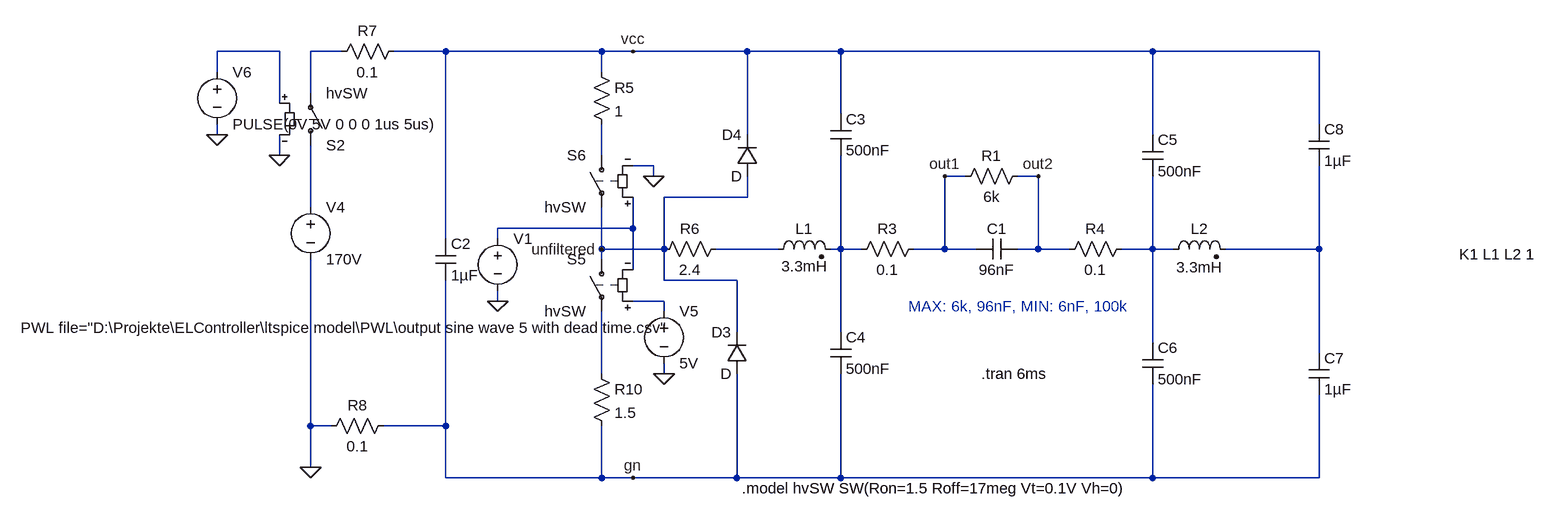
[diagram p0: schematic Filter Test R4d.asc]
Filter Test R4d.asc, the LTspice schematic file:
Version 4
SHEET 1 2672 680
WIRE -848 -224 -944 -224
WIRE -752 -224 -800 -224
WIRE -592 -224 -672 -224
WIRE -352 -224 -592 -224
WIRE -304 -224 -352 -224
WIRE -128 -224 -304 -224
WIRE 16 -224 -128 -224
WIRE 496 -224 16 -224
WIRE 752 -224 496 -224
WIRE -944 -192 -944 -224
WIRE -352 -192 -352 -224
WIRE -800 -160 -800 -224
WIRE -848 -144 -848 -224
WIRE 16 -128 16 -224
WIRE 752 -112 752 -224
WIRE -944 -96 -944 -112
WIRE -128 -96 -128 -224
WIRE 496 -96 496 -224
WIRE -848 -64 -848 -96
WIRE -352 -64 -352 -112
WIRE -272 -48 -304 -48
WIRE -272 -32 -272 -48
WIRE 208 -32 176 -32
WIRE 320 -32 288 -32
WIRE -128 0 -128 -32
WIRE -128 0 -256 0
WIRE -800 16 -800 -80
WIRE -304 48 -304 0
WIRE -304 48 -512 48
WIRE -592 64 -592 -224
WIRE -512 64 -512 48
WIRE -352 80 -352 16
WIRE -256 80 -256 0
WIRE -256 80 -352 80
WIRE -80 80 -176 80
WIRE 16 80 16 -64
WIRE 16 80 0 80
WIRE 48 80 16 80
WIRE 176 80 176 -32
WIRE 176 80 128 80
WIRE 224 80 176 80
WIRE 320 80 320 -32
WIRE 320 80 288 80
WIRE 368 80 320 80
WIRE 496 80 496 -32
WIRE 496 80 448 80
WIRE 528 80 496 80
WIRE 752 80 752 -48
WIRE 752 80 608 80
WIRE -352 96 -352 80
WIRE -304 112 -304 48
WIRE -256 128 -256 80
WIRE -144 128 -256 128
WIRE -512 160 -512 144
WIRE -256 160 -304 160
WIRE -256 176 -256 160
WIRE -144 208 -144 128
WIRE 16 208 16 80
WIRE 496 224 496 80
WIRE 752 240 752 80
WIRE -352 272 -352 176
WIRE -256 272 -256 256
WIRE -800 352 -800 96
WIRE -768 352 -800 352
WIRE -592 352 -592 128
WIRE -592 352 -688 352
WIRE -800 416 -800 352
WIRE -592 432 -592 352
WIRE -352 432 -352 352
WIRE -352 432 -592 432
WIRE -304 432 -352 432
WIRE -144 432 -144 272
WIRE -144 432 -304 432
WIRE 16 432 16 272
WIRE 16 432 -144 432
WIRE 496 432 496 288
WIRE 496 432 16 432
WIRE 752 432 752 304
WIRE 752 432 496 432
FLAG 176 -32 out1
FLAG 320 -32 out2
FLAG -800 416 0
FLAG -256 272 0
FLAG -272 -32 0
FLAG -512 160 0
FLAG -304 -224 vcc
FLAG -304 432 gn
FLAG -352 80 unfiltered
FLAG -848 -64 0
FLAG -944 -96 0
SYMBOL voltage -512 48 R0
WINDOW 123 0 0 Left 0
WINDOW 39 0 0 Left 0
WINDOW 3 -734 153 Left 2
SYMATTR Value PWL file="D:\Projekte\ELController\ltspice model\PWL\output sine wave 5 with dead time.csv"
SYMATTR InstName V1
SYMBOL cap 288 64 R90
WINDOW 0 0 32 VBottom 2
WINDOW 3 32 32 VTop 2
SYMATTR InstName C1
SYMATTR Value 96nF
SYMBOL ind2 -96 96 R270
WINDOW 0 32 56 VTop 2
WINDOW 3 5 56 VBottom 2
SYMATTR InstName L1
SYMATTR Value 3.3mH
SYMATTR SpiceLine Ipk=1
SYMATTR Type ind
SYMBOL ind2 512 96 R270
WINDOW 0 32 56 VTop 2
WINDOW 3 4 56 VBottom 2
SYMATTR InstName L2
SYMATTR Value 3.3mH
SYMATTR SpiceLine Ipk=1
SYMATTR Type ind
SYMBOL res 304 -48 R90
WINDOW 0 0 56 VBottom 2
WINDOW 3 32 56 VTop 2
SYMATTR InstName R1
SYMATTR Value 6k
SYMBOL sw -352 80 M0
SYMATTR InstName S5
SYMATTR Value hvSW
SYMBOL sw -352 -80 M0
SYMATTR InstName S6
SYMATTR Value hvSW
SYMBOL voltage -256 160 R0
WINDOW 123 0 0 Left 0
WINDOW 39 0 0 Left 0
SYMATTR InstName V5
SYMATTR Value 5V
SYMBOL res -160 64 R90
WINDOW 0 0 56 VBottom 2
WINDOW 3 32 56 VTop 2
SYMATTR InstName R6
SYMATTR Value 2.4
SYMBOL cap -608 64 R0
SYMATTR InstName C2
SYMATTR Value 1µF
SYMBOL res -656 -240 R90
WINDOW 0 0 56 VBottom 2
WINDOW 3 32 56 VTop 2
SYMATTR InstName R7
SYMATTR Value 0.1
SYMBOL res -672 336 R90
WINDOW 0 0 56 VBottom 2
WINDOW 3 32 56 VTop 2
SYMATTR InstName R8
SYMATTR Value 0.1
SYMBOL voltage -800 0 R0
WINDOW 123 0 0 Left 0
WINDOW 39 0 0 Left 0
SYMATTR InstName V4
SYMATTR Value 170V
SYMBOL res 144 64 R90
WINDOW 0 0 56 VBottom 2
WINDOW 3 32 56 VTop 2
SYMATTR InstName R3
SYMATTR Value 0.1
SYMBOL res 464 64 R90
WINDOW 0 0 56 VBottom 2
WINDOW 3 32 56 VTop 2
SYMATTR InstName R4
SYMATTR Value 0.1
SYMBOL res -368 -208 R0
SYMATTR InstName R5
SYMATTR Value 1
SYMBOL res -368 256 R0
SYMATTR InstName R10
SYMATTR Value 1.5
SYMBOL diode -128 272 R180
WINDOW 0 24 64 Left 2
WINDOW 3 24 0 Left 2
SYMATTR InstName D3
SYMBOL diode -112 -32 R180
WINDOW 0 24 64 Left 2
WINDOW 3 24 0 Left 2
SYMATTR InstName D4
SYMBOL sw -800 -64 M180
SYMATTR InstName S2
SYMATTR Value hvSW
SYMBOL voltage -944 -208 R0
WINDOW 123 0 0 Left 0
WINDOW 39 0 0 Left 0
SYMATTR InstName V6
SYMATTR Value PULSE(0V 5V 0 0 0 1us 5us)
SYMBOL cap 0 -128 R0
SYMATTR InstName C3
SYMATTR Value 500nF
SYMBOL cap 0 208 R0
SYMATTR InstName C4
SYMATTR Value 500nF
SYMBOL cap 480 -96 R0
SYMATTR InstName C5
SYMATTR Value 500nF
SYMBOL cap 480 224 R0
SYMATTR InstName C6
SYMATTR Value 500nF
SYMBOL cap 736 240 R0
SYMATTR InstName C7
SYMATTR Value 1µF
SYMBOL cap 736 -112 R0
SYMATTR InstName C8
SYMATTR Value 1µF
TEXT 232 272 Left 2 !.tran 6ms
TEXT -136 448 Left 2 !.model hvSW SW(Ron=1.5 Roff=17meg Vt=0.1V Vh=0)
TEXT 120 168 Left 2 ;MAX: 6k, 96nF, MIN: 6nF, 100k
TEXT 968 88 Left 2 !K1 L1 L2 1

The netlist it stands for:
* Filter Test R4d.asc
V1 N005 0 PWL file="D:\Projekte\ELController\ltspice model\PWL\output sine wave 5 with dead time.csv"
C1 out2 out1 96nF
L1 N006 N007 3.3mH Ipk=1
L2 N008 N009 3.3mH Ipk=1
R1 out2 out1 6k
S5 unfiltered N011 N010 N005 hvSW
S6 N003 unfiltered N005 0 hvSW
V5 N010 0 5V
R6 N006 unfiltered 2.4
C2 vcc gn 1µF
R7 vcc N002 0.1
R8 gn 0 0.1
V4 N004 0 170V
R3 out1 N007 0.1
R4 N008 out2 0.1
R5 vcc N003 1
R10 N011 gn 1.5
D3 gn unfiltered D
D4 unfiltered vcc D
S2 N004 N002 N001 0 hvSW
V6 N001 0 PULSE(0V 5V 0 0 0 1us 5us)
C3 vcc N007 500nF
C4 N007 gn 500nF
C5 vcc N008 500nF
C6 N008 gn 500nF
C7 N009 gn 1µF
C8 vcc N009 1µF
.model D D
.lib standard.dio
.tran 6ms
.model hvSW SW(Ron=1.5 Roff=17meg Vt=0.1V Vh=0)
* MAX: 6k, 96nF, MIN: 6nF, 100k
K1 L1 L2 1
.backanno
.end